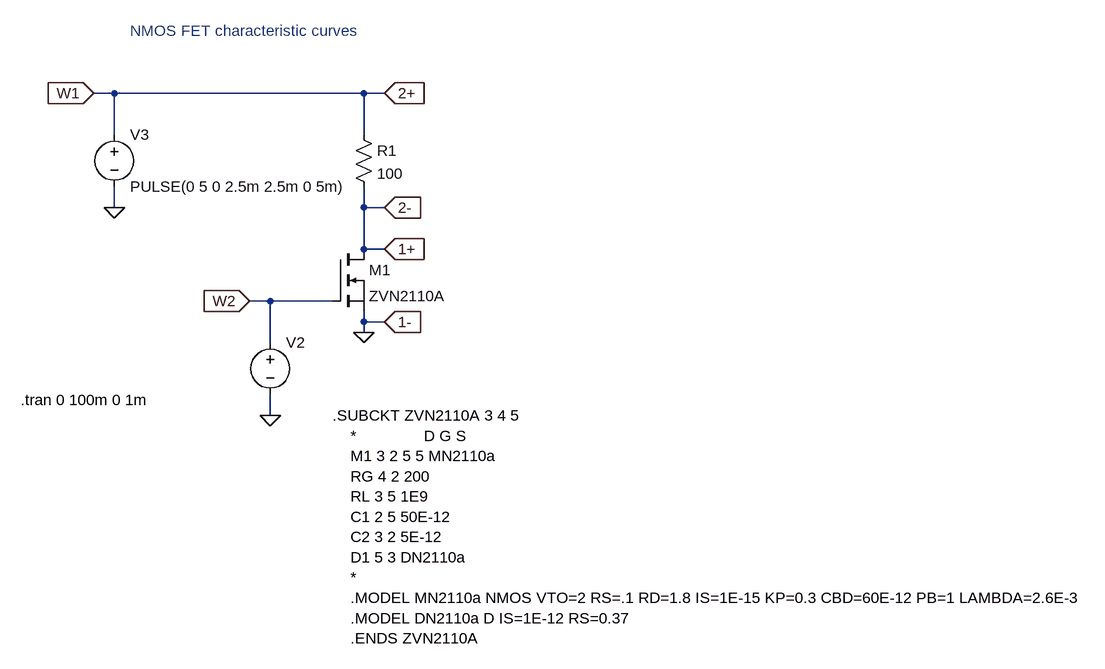
[diagram p0: schematic nmos_curve.asc]
nmos_curve.asc, the LTspice schematic file:
Version 4
SHEET 1 1268 784
WIRE -320 -144 -352 -144
WIRE 64 -144 -320 -144
WIRE 96 -144 64 -144
WIRE -320 -80 -320 -144
WIRE 64 -80 64 -144
WIRE -320 32 -320 0
WIRE 64 32 64 0
WIRE 96 32 64 32
WIRE 64 96 64 32
WIRE 96 96 64 96
WIRE -80 176 -112 176
WIRE 16 176 -80 176
WIRE 64 208 64 192
WIRE 96 208 64 208
WIRE 64 224 64 208
WIRE -80 240 -80 176
WIRE -80 352 -80 320
FLAG 64 224 0
FLAG -80 352 0
FLAG -320 32 0
FLAG -112 176 W2
IOPIN -112 176 In
FLAG 96 -144 2+
IOPIN 96 -144 In
FLAG 96 32 2-
IOPIN 96 32 In
FLAG -352 -144 W1
IOPIN -352 -144 In
FLAG 96 96 1+
IOPIN 96 96 In
FLAG 96 208 1-
IOPIN 96 208 In
SYMBOL nmos 16 96 R0
SYMATTR InstName M1
SYMATTR Value ZVN2110A
SYMATTR Prefix X
SYMBOL res 48 -96 R0
SYMATTR InstName R1
SYMATTR Value 100
SYMBOL voltage -320 -96 R0
WINDOW 123 0 0 Left 0
WINDOW 39 0 0 Left 0
SYMATTR InstName V3
SYMATTR Value PULSE(0 5 0 2.5m 2.5m 0 5m)
SYMBOL voltage -80 224 R0
WINDOW 3 24 44 Invisible 2
SYMATTR Value PWL REPEAT FOREVER (5m 2 5.00000001m 2.1 10m 2.1 10.0000001m 2.2 15m 2.2 15.000001m 2.3 20m 2.3 20.00001m 2.4 25m 2.4 25.0000001m 2) ENDREPEAT
SYMATTR InstName V2
TEXT -464 328 Left 2 !.tran 0 100m 0 1m
TEXT -296 -240 Left 2 ;NMOS FET characteristic curves
TEXT 16 352 Left 2 !.SUBCKT ZVN2110A 3 4 5\n    *               D G S\n    M1 3 2 5 5 MN2110a\n    RG 4 2 200\n    RL 3 5 1E9\n    C1 2 5 50E-12\n    C2 3 2 5E-12\n    D1 5 3 DN2110a\n    *\n    .MODEL MN2110a NMOS VTO=2 RS=.1 RD=1.8 IS=1E-15 KP=0.3 CBD=60E-12 PB=1 LAMBDA=2.6E-3\n    .MODEL DN2110a D IS=1E-12 RS=0.37\n    .ENDS ZVN2110A

The netlist it stands for:
* nmos_curve.asc
XM1 1+ W2 0 ZVN2110A  ; pins D G S
R1 W1 1+ 100
V3 W1 0 PULSE(0 5 0 2.5m 2.5m 0 5m)
V2 W2 0 PWL REPEAT FOREVER (5m 2 5.00000001m 2.1 10m 2.1 10.0000001m 2.2 15m 2.2 15.000001m 2.3 20m 2.3 20.00001m 2.4 25m 2.4 25.0000001m 2) ENDREPEAT
.tran 0 100m 0 1m
* NMOS FET characteristic curves
.SUBCKT ZVN2110A 3 4 5
    *               D G S
    M1 3 2 5 5 MN2110a
    RG 4 2 200
    RL 3 5 1E9
    C1 2 5 50E-12
    C2 3 2 5E-12
    D1 5 3 DN2110a
    *
    .MODEL MN2110a NMOS VTO=2 RS=.1 RD=1.8 IS=1E-15 KP=0.3 CBD=60E-12 PB=1 LAMBDA=2.6E-3
    .MODEL DN2110a D IS=1E-12 RS=0.37
    .ENDS ZVN2110A
.backanno
.end